# EasyEDA schematic LcsNodes-Main-Controller-Board-A.02.04.json

## Sheets
1 Controller, CAN, NVM: TITLE: LcsNodes-Main-Controller-Board-Atmega; REV: A.02.06; Date: 2022-09-20; Sheet: 2/3; Drawn By: helmut-f; Company: Your Company
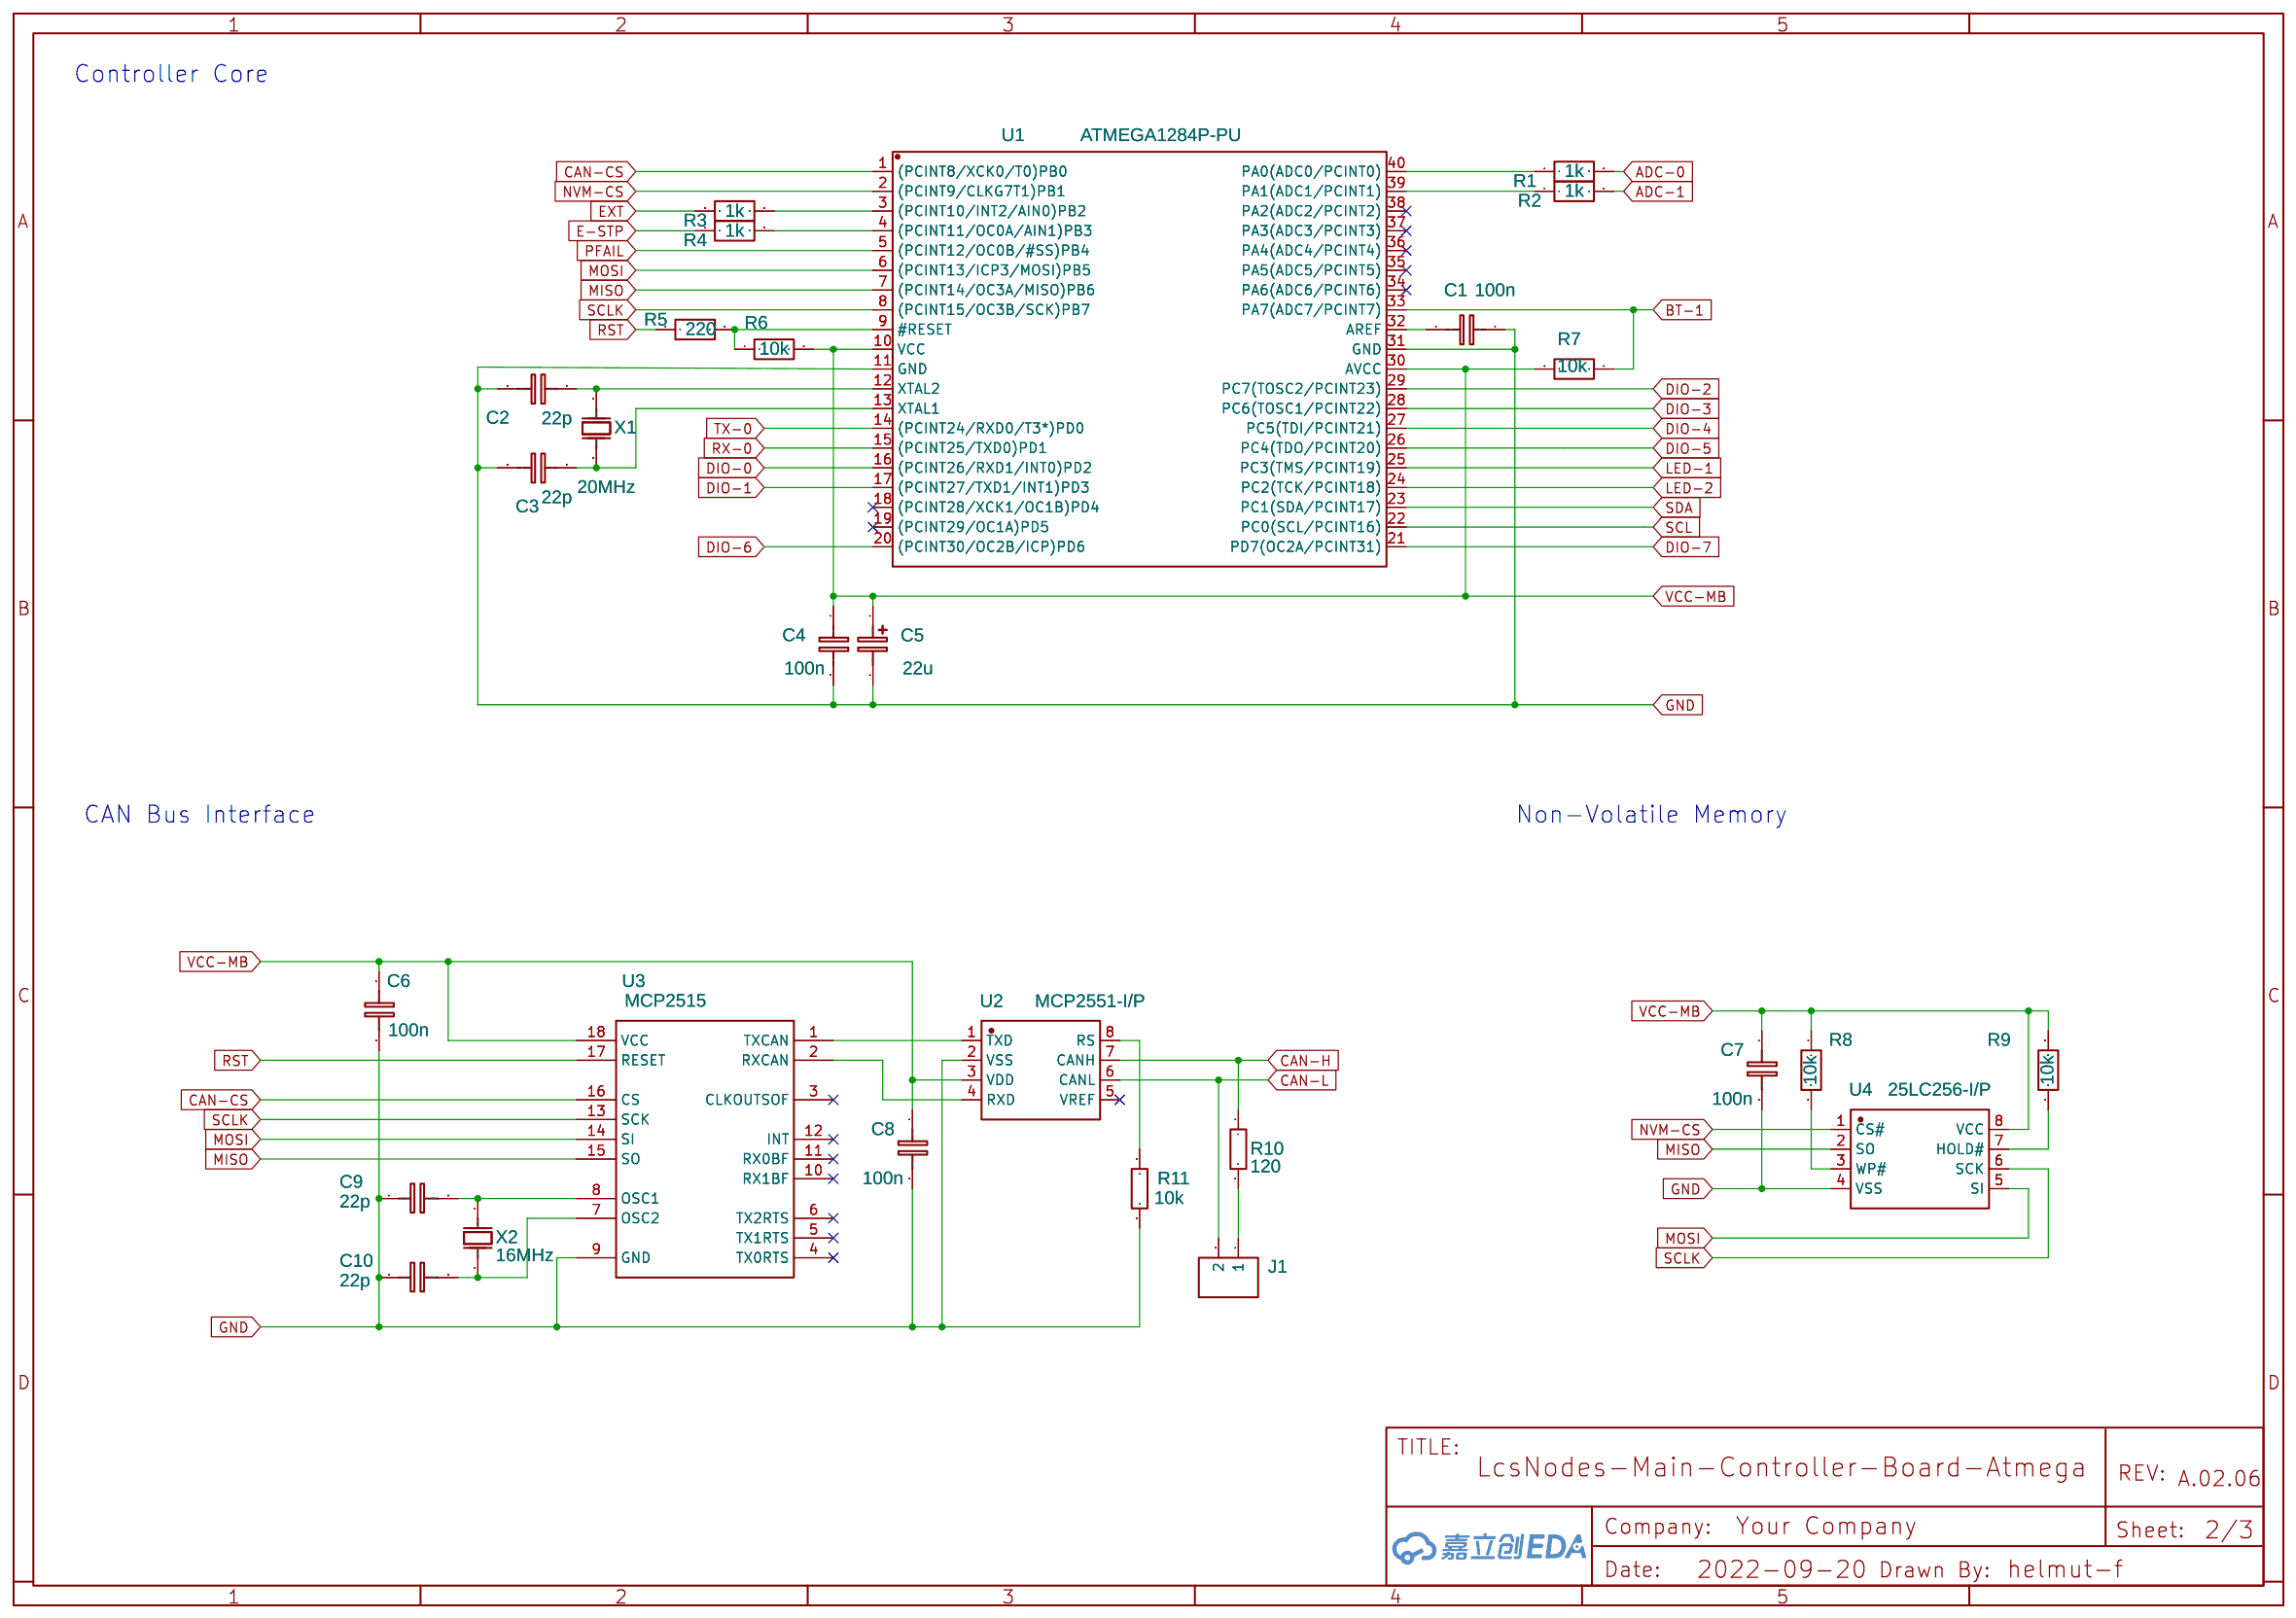
[diagram p0: Controller, CAN, NVM]
2 Connector LCS, FTDI, ISP, Power Supply: Sheet: 3/3
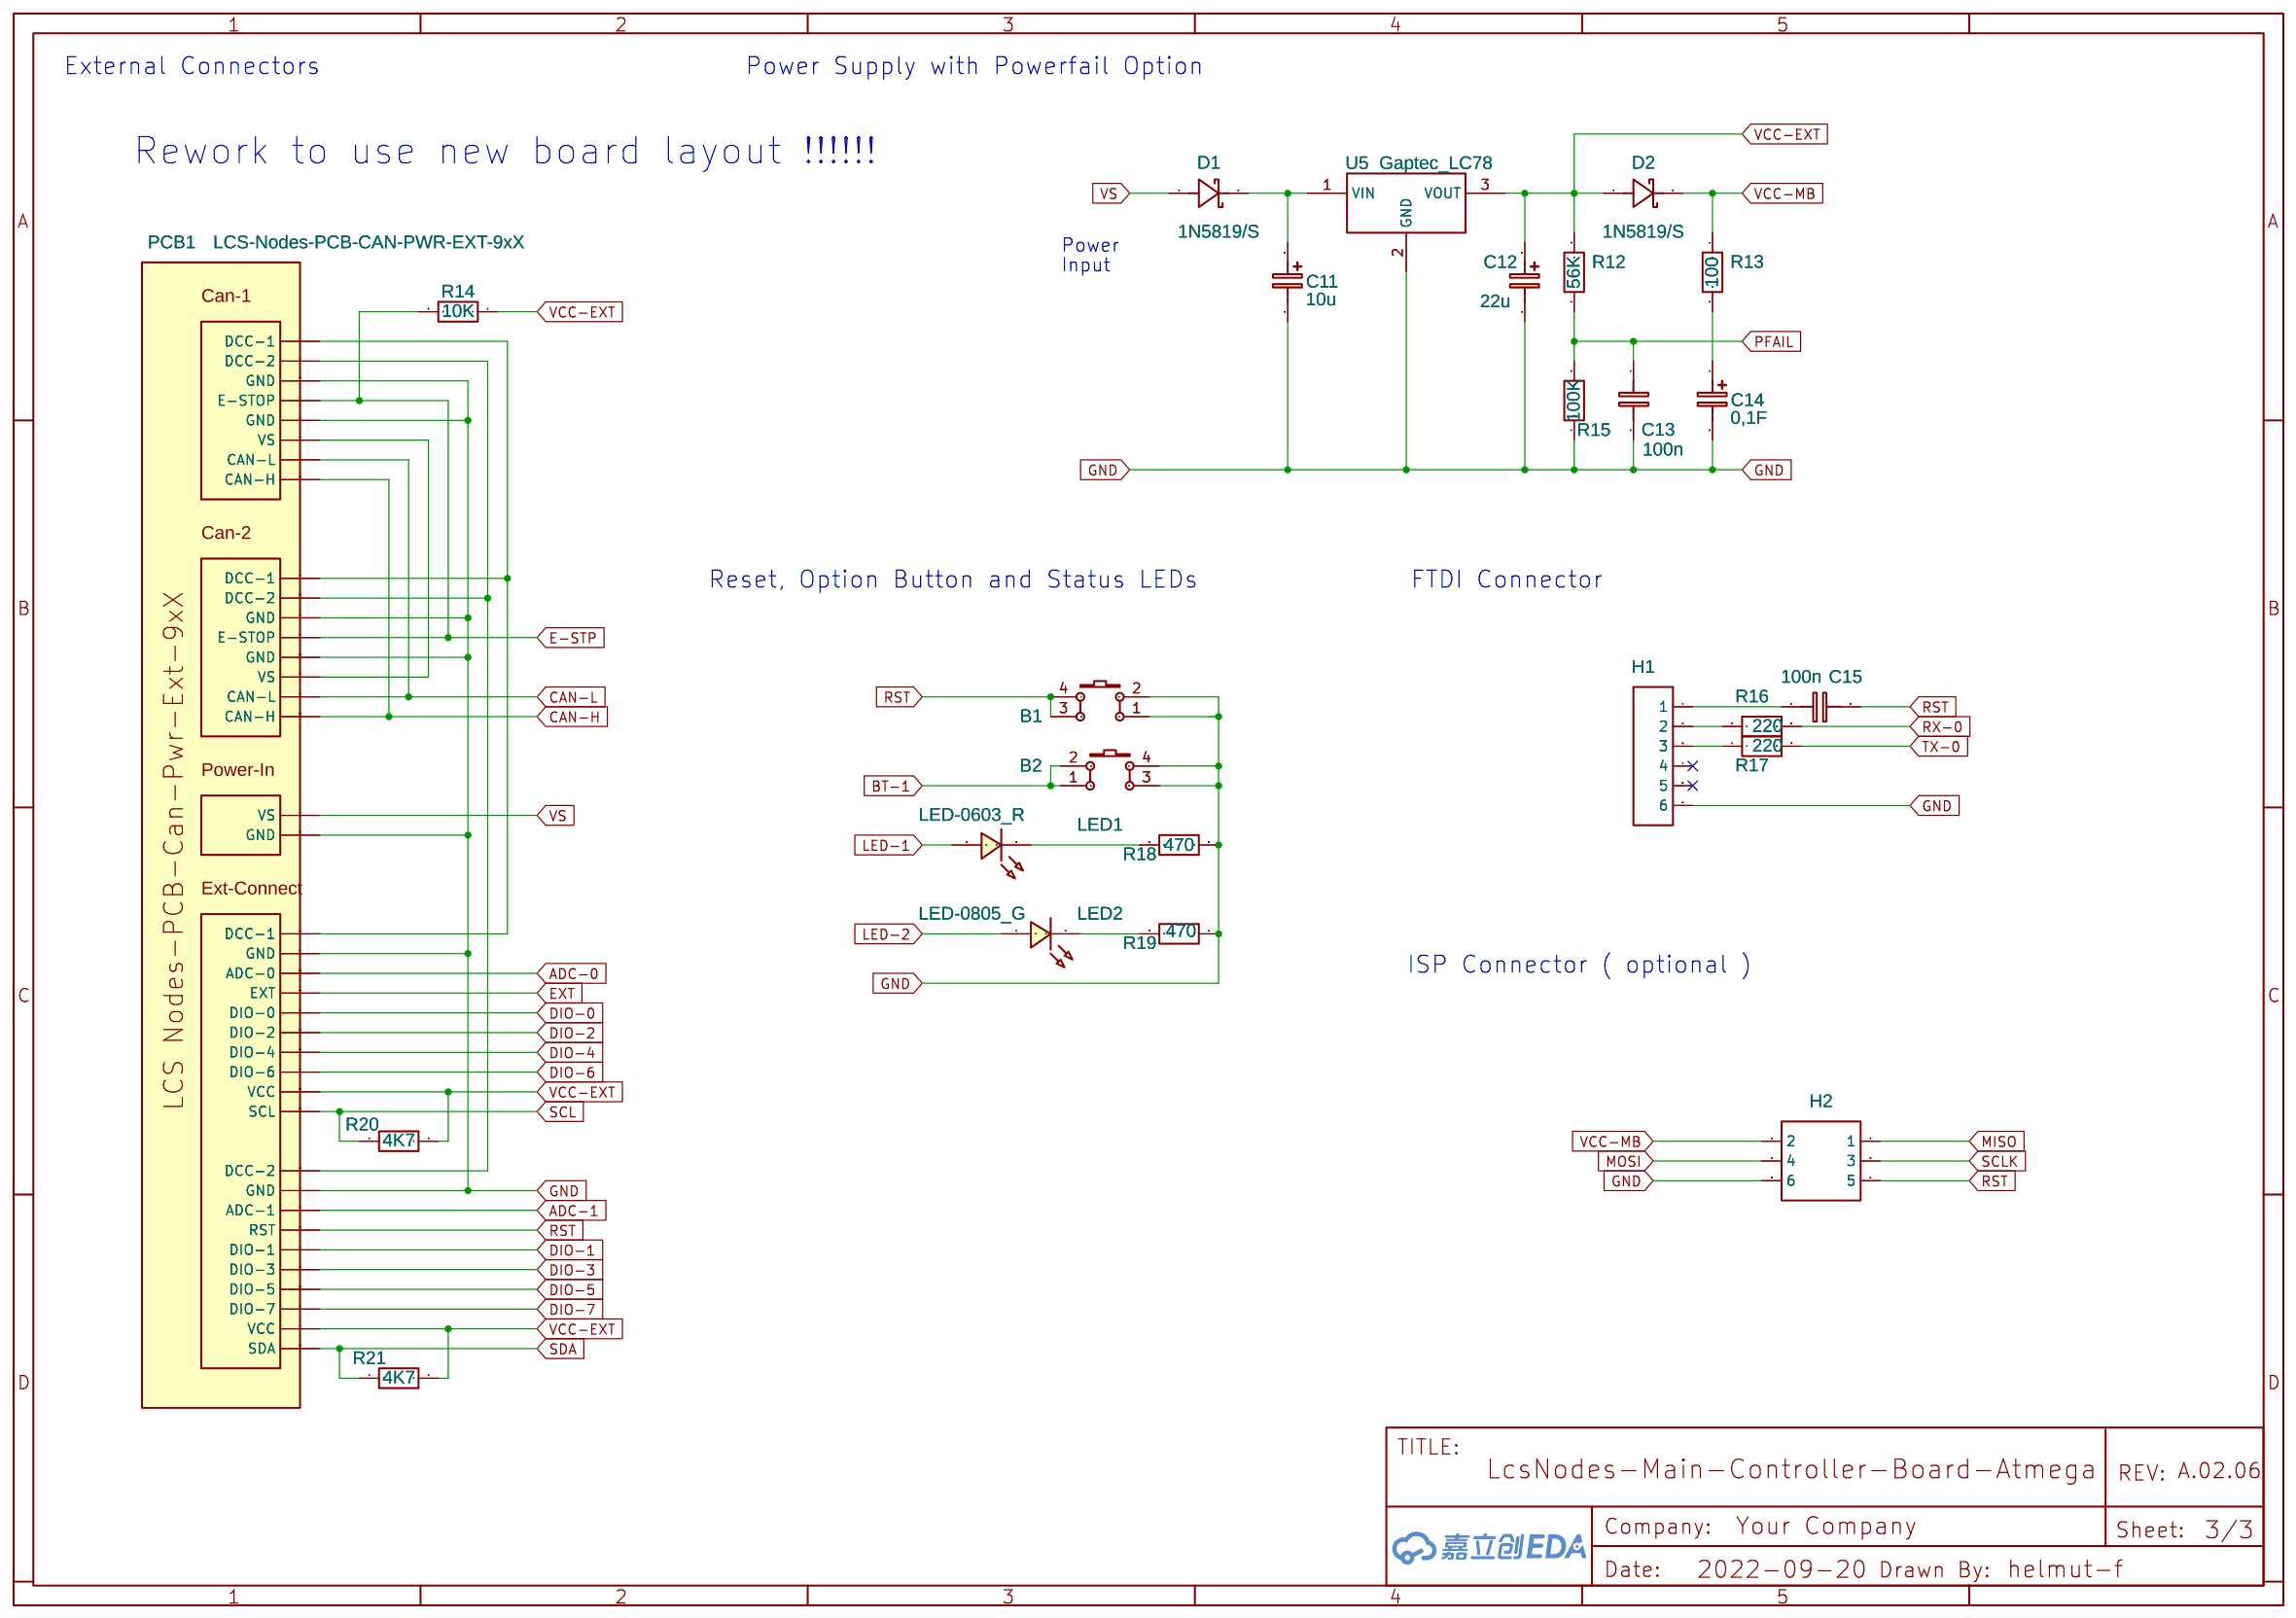
[diagram p1: Connector LCS, FTDI, ISP, Power Supply]
3 Block Diagram: Date: 2023-02-08; Sheet: 1/3
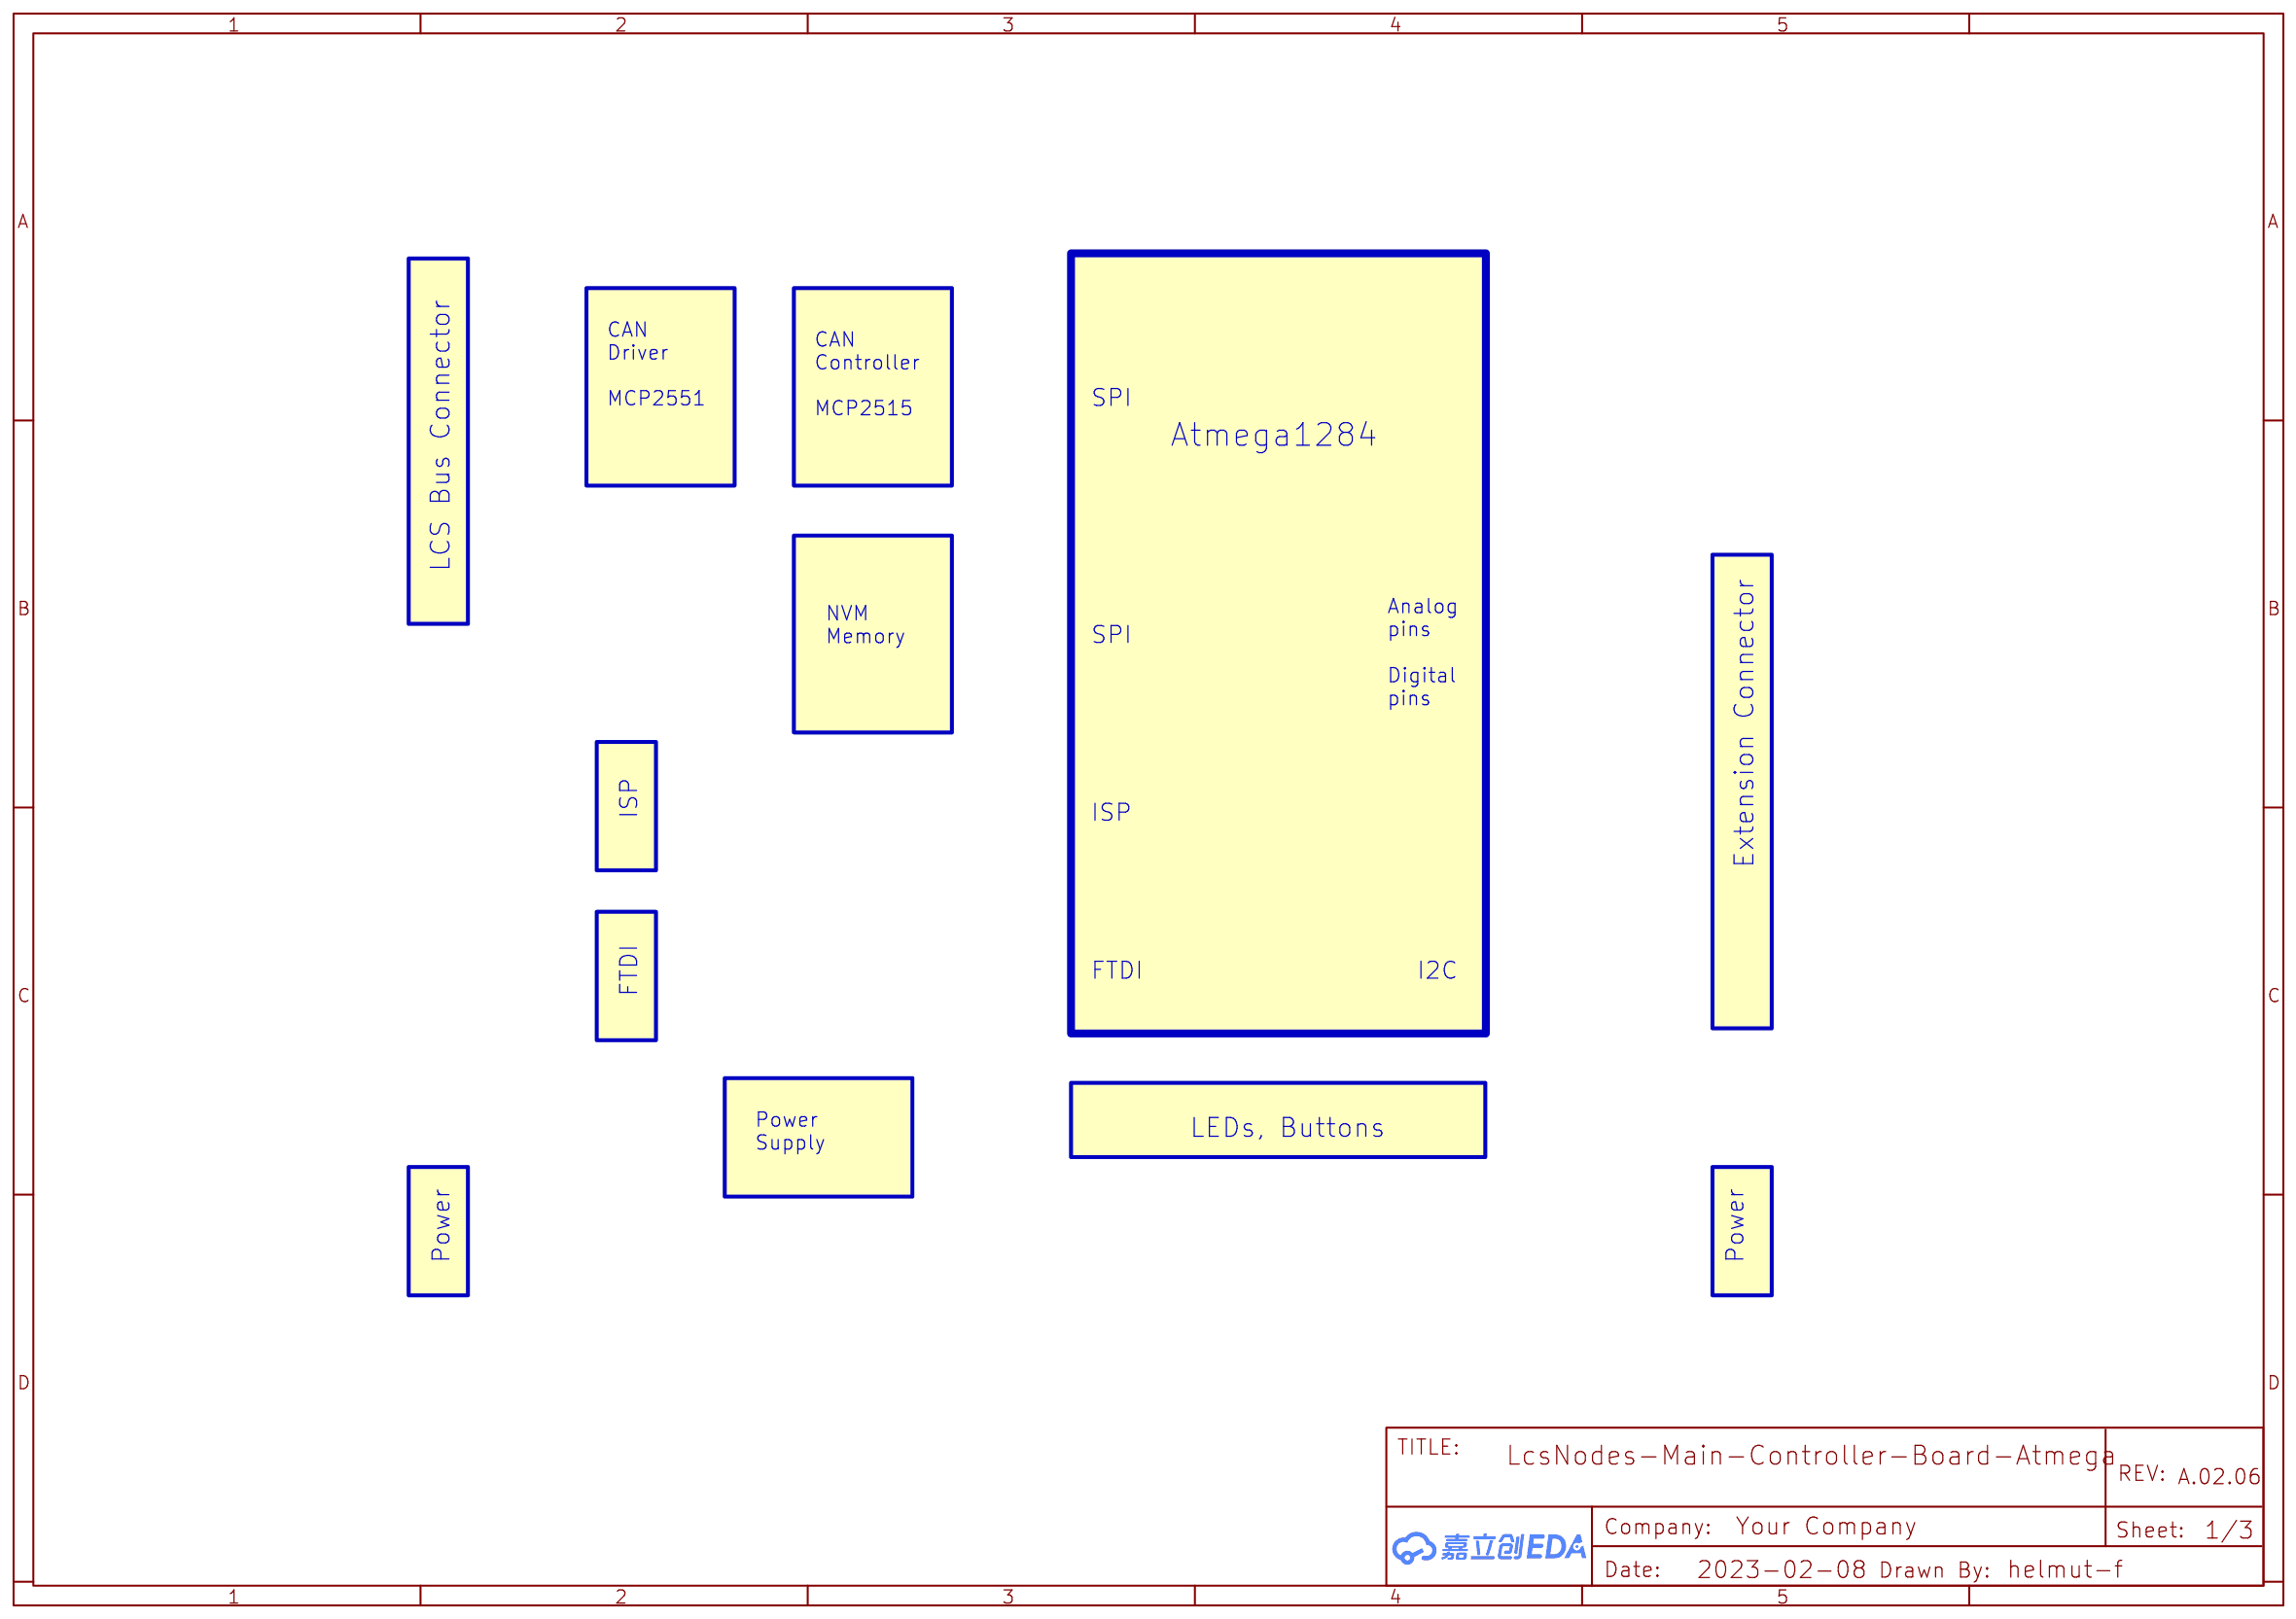
[diagram p2: Block Diagram]

## Parts
sheet Connector LCS, FTDI, ISP, Power Supply
B1  Reset  [KEY-TH_4P-L6.0-W6.0-P4.50-LS6.5]
B2  Opt  [KEY-TH_4P-L6.0-W6.0-P4.50-LS6.5]
C11  10u  [CAP-D5.0×H5.5]
C12  22u  [CAP-D5.0×H5.5]
C13  100n  [C1206]
C14  0,1F  [CAP-D12.5XF5.0]
C15  100n  [C1206]
D1  1N5819/S  [SMA_L4.3-W2.6-LS5.2-R-RD]
D2  1N5819/S  [SMA_L4.3-W2.6-LS5.2-R-RD]
H1  HDR-F-2.54_1x6  [HDR-F-2.54_1X6]
H2  HDR-F-2.54_2x3  [HDR-F-2.54_2X3]
LED1  LED-0603_R  [LED-1206]
LED2  LED-0805_G  [LED-1206]
PCB1  LCS-Nodes-PCB-CAN-PWR-EXT-9xX  [LCS-NODES-PCB-9X9]
R12  56K  [R1206]
R13  100  [R1206]
R14  10K  [R1206]
R15  100K  [R1206]
R16  220  [R1206]
R17  220  [R1206]
R18  470  [R1206]
R19  470  [R1206]
R20  4K7  [R1206]
R21  4K7  [R1206]
U5  Gaptec_LC78  [GAPTEC_LC78]
sheet Controller, CAN, NVM
C1  100n  [C1206]
C2  22p  [C1206]
C3  22p  [C1206]
C4  100n  [C1206]
C5  22u  [CAP-D5.0XH5.5]
C6  100n  [C1206]
C7  100n  [C1206]
C8  100n  [C1206]
C9  22p  [C1206]
C10  22p  [C1206]
J1  HDR-M-2.54_1x2  [HDR-M-2.54_1X2]
R1  1k  [R1206]
R2  1k  [R1206]
R3  1k  [R1206]
R4  1k  [R1206]
R5  220  [R1206]
R6  10k  [R1206]
R7  10k  [R1206]
R8  10k  [R1206]
R9  10k  [R1206]
R10  120  [R1206]
R11  10k  [R1206]
U1  ATMEGA1284P-PU  [PDIP-40_L52.3-W13.8-P2.54-LS15.24-BL]
U2  MCP2551-I/P  [PDIP-8_L9.3-W6.4-P2.54-LS7.6-BL]
U3  MCP2515  [18-DIP]
U4  25LC256-I/P  [PDIP-8_L9.3-W6.4-P2.54-LS7.6-BL]
X1  20MHz  [HC-49-SMD_L12.0-W4.8]
X2  16MHz  [HC-49-SMD_L12.0-W4.8]

## Library data of the parts
B1 B2 = K4-6×6_TH: Supplier: LCSC; Supplier Part: C136684; Manufacturer: 韩国韩荣; Manufacturer Part: K2-1102DP-E4SW-04; Contributor: LCEDA_Lib; Package Display: No
C11 C12 = CE_SMD_D5.0×H5.5_EU: Contributor: LCEDA_Lib
C13 = C_RAD-0.2_EU: Contributor: LCEDA_Lib
C14 = C_Tan_SMD_A_EU: Contributor: LCEDA_Lib
C2-C4 C6-C10 C15 = C_0603_EU: Contributor: LCEDA_Lib; Package Display: No
D1 D2 = 1N5819/S: Supplier: LCSC; Supplier Part: C9900003833; JLCPCB Part Class: Extended Part; Contributor: LCSC
H1 = HDR-F-2.54_1x6: Supplier Part: C40877; Supplier: LCSC; Contributor: LCEDA_Lib
H2 = HDR-F-2.54_2x3: Supplier Part: C65114; Supplier: LCSC; Contributor: LCEDA_Lib
LED1 = LED-0603_R: Manufacturer: EVERLIGHT(台湾亿光); Manufacturer Part: 19-217/R6C-AL1M2VY/3T; Supplier Part: C72044; Supplier: LCSC; Contributor: LCEDA_01
LED2 = LED-0805_G: Manufacturer: 国星光电; Manufacturer Part: NCD0805G1; Supplier Part: C84260; Contributor: LCEDA_Lib
PCB1 = LCS-Nodes-PCB-CAN-PWR-EXT-9xX: Contributor: helmut-f; Package Display: No
R1-R9 R12-R17 R20 R21 = R_AXIAL-0.3_EU: Contributor: LCEDA_Lib
R18 R19 = R_0805_EU: Contributor: LCEDA_Lib
U5 = Gaptec_LC78: Contributor: SpicyMemeBoi
C1 = C_RAD-0.1_EU: Contributor: LCEDA_Lib; Package Display: No
C5 = CE_TH_D4.0×F1.5_EU: Contributor: LCEDA_Lib
J1 = HDR-M-2.54_1x2: Supplier Part: C124375; Supplier: LCSC; Contributor: LCEDA_Lib
R10 R11 = RESISTOR-AXIAL-0.1
U1 = ATMEGA1284P-PU: Supplier: LCSC; Supplier Part: C116839; Manufacturer: Microchip Tech; Contributor: LCSC; JLCPCB Part Class: Extended Part
U2 = MCP2551-I/P: Supplier: LCSC; Supplier Part: C411627; Manufacturer: Microchip Tech; Contributor: LCSC; JLCPCB Part Class: Extended Part
U3 = MCP2515: Microchip CAN Controller with SPI Interface; Manufacturer: Microchip; Contributor: samvanbrussel; Package Display: No
U4 = 25LC256-I/P: Supplier: LCSC; Supplier Part: C511271; Manufacturer: Microchip Tech; Contributor: LCSC; JLCPCB Part Class: Extended Part
X1 X2 = X49SM16MSD2SI: Supplier: LCSC; Manufacturer: YXC; Supplier Part: C90678; JLCPCB Part Class: Extended Part

## Nets
GND: B1.1 B1.2 B2.3 B2.4 C1.1 C2.2 C3.2 C4.2 C5.2 C6.2 C7.2 C8.2 C9.1 C10.1 C11.2 C12.2 C13.2 C14.2 H1.6 H2.6 PCB1.3(GND) PCB1.5(GND) PCB1.13(GND) PCB1.15(GND) PCB1.21(GND) PCB1.31(GND) PCB1.41(GND) R11.2 R15.1 R18.1 R19.1 U1.11(GND) U1.31(GND) U2.2(VSS) U3.9(GND) U4.4(VSS) U5.2(GND)
VCC-EXT: C12.1 D2.1(A) PCB1.38(VCC) PCB1.48(VCC) R12.2 R14.1 R20.2 R21.2 U5.3(VOUT)
VCC-MB: C4.1 C5.1 C6.1 C7.1 C8.1 D2.2(K) H2.2 R6.2 R7.2 R8.1 R9.2 R13.1 U1.10(VCC) U1.30(AVCC) U2.3(VDD) U3.18(VCC) U4.8(VCC)
ADC-0: PCB1.32(ADC-0) R1.2
ADC-1: PCB1.42(ADC-1) R2.2
BT-1: B2.1 B2.2 R7.1 U1.33(PA7(ADC7/PCINT7))
CAN-CS: U1.1((PCINT8/XCK0/T0)PB0) U3.16(CS)
CAN-H: PCB1.8(CAN-H) PCB1.18(CAN-H) R10.1 U2.7(CANH)
CAN-L: J1.2 PCB1.7(CAN-L) PCB1.17(CAN-L) U2.6(CANL)
DIO-0: PCB1.34(DIO-0) U1.16((PCINT26/RXD1/INT0)PD2)
DIO-1: PCB1.44(DIO-1) U1.17((PCINT27/TXD1/INT1)PD3)
DIO-2: PCB1.35(DIO-2) U1.29(PC7(TOSC2/PCINT23))
DIO-3: PCB1.45(DIO-3) U1.28(PC6(TOSC1/PCINT22))
DIO-4: PCB1.36(DIO-4) U1.27(PC5(TDI/PCINT21))
DIO-5: PCB1.46(DIO-5) U1.26(PC4(TDO/PCINT20))
DIO-6: PCB1.37(DIO-6) U1.20((PCINT30/OC2B/ICP)PD6)
DIO-7: PCB1.47(DIO-7) U1.21(PD7(OC2A/PCINT31))
E-STP: PCB1.4(E-STOP) PCB1.14(E-STOP) R4.1 R14.2
EXT: PCB1.33(EXT) R3.1
LED-1: LED1.1 U1.25(PC3(TMS/PCINT19))
LED-2: LED2.1 U1.24(PC2(TCK/PCINT18))
MISO: H2.1 U1.7((PCINT14/OC3A/MISO)PB6) U3.15(SO) U4.2(SO)
MOSI: H2.4 U1.6((PCINT13/ICP3/MOSI)PB5) U3.14(SI) U4.5(SI)
NVM-CS: U1.2((PCINT9/CLKG7T1)PB1) U4.1(CS#)
PFAIL: C13.1 R12.1 R15.2 U1.5((PCINT12/OC0B/#SS)PB4)
RST: B1.3 B1.4 C15.2 H2.5 PCB1.43(RST) R5.1 U3.17(RESET)
RX-0: R16.2 U1.15((PCINT25/TXD0)PD1)
SCL: PCB1.39(SCL) R20.1 U1.22(PC0(SCL/PCINT16))
SCLK: H2.3 U1.8((PCINT15/OC3B/SCK)PB7) U3.13(SCK) U4.6(SCK)
SDA: PCB1.49(SDA) R21.1 U1.23(PC1(SDA/PCINT17))
TX-0: R17.2 U1.14((PCINT24/RXD0/T3*)PD0)
VS: D1.1(A) PCB1.20(VS)
Net-(C1-2): C1.2 U1.32(AREF)
Net-(C2-1): C2.1 U1.12(XTAL2) X1.1(OSC1)
Net-(C3-1): C3.1 U1.13(XTAL1) X1.2(OSC2)
Net-(C9-2): C9.2 U3.8(OSC1) X2.1(OSC1)
Net-(C10-2): C10.2 U3.7(OSC2) X2.2(OSC2)
Net-(C11-1): C11.1 D1.2(K) U5.1(VIN)
Net-(C14-1): C14.1 R13.2
Net-(C15-1): C15.1 H1.1
Net-(H1-2): H1.2 R16.1
Net-(H1-3): H1.3 R17.1
Net-(J1-1): J1.1 R10.2
Net-(LED1-2): LED1.2 R18.2
Net-(LED2-2): LED2.2 R19.2
Net-(PCB1-1): PCB1.1(DCC-1) PCB1.11(DCC-1) PCB1.30(DCC-1)
Net-(PCB1-2): PCB1.2(DCC-2) PCB1.12(DCC-2) PCB1.40(DCC-2)
Net-(PCB1-6): PCB1.6(VS) PCB1.16(VS)
Net-(R1-1): R1.1 U1.40(PA0(ADC0/PCINT0))
Net-(R2-1): R2.1 U1.39(PA1(ADC1/PCINT1))
Net-(R3-2): R3.2 U1.3((PCINT10/INT2/AIN0)PB2)
Net-(R4-2): R4.2 U1.4((PCINT11/OC0A/AIN1)PB3)
Net-(R5-2): R5.2 R6.1 U1.9(#RESET)
Net-(R8-2): R8.2 U4.3(WP#)
Net-(R9-1): R9.1 U4.7(HOLD#)
Net-(R11-1): R11.1 U2.8(RS)
Net-(U2-1): U2.1(TXD) U3.1(TXCAN)
Net-(U2-4): U2.4(RXD) U3.2(RXCAN)

Not connected (* = marked no-connect by the designer): H1 4* 5*; U1 18((PCINT28/XCK1/OC1B)PD4)* 19((PCINT29/OC1A)PD5)* 34(PA6(ADC6/PCINT6))* 35(PA5(ADC5/PCINT5))* 36(PA4(ADC4/PCINT4))* 37(PA3(ADC3/PCINT3))* 38(PA2(ADC2/PCINT2))*; U2 5(VREF)*; U3 3(CLKOUTSOF)* 4(TX0RTS)* 5(TX1RTS)* 6(TX2RTS)* 10(RX1BF)* 11(RX0BF)* 12(INT)*

## Notes on the sheets
sheet 1
- Controller Core
- CAN Bus Interface
- Non-Volatile Memory
sheet 2
- External Connectors
- Power Supply with Powerfail Option
- Rework to use new board layout !!!!!!
- Input
- Power
- Reset, Option Button and Status LEDs
- FTDI Connector
- ISP Connector ( optional )
sheet 3
- CAN
  Driver
  MCP2551
- CAN
  Controller
  MCP2515
- SPI
- Atmega1284
- LCS Bus Connector
- Analog
  pins
- NVM
  Memory
- SPI
- Digital
  pins
- ISP
- ISP
- Extension Connector
- FTDI
- I2C
- FTDI
- Power
  Supply
- LEDs, Buttons
- Power
- Power
